# EAGLE schematic hub_keyboard (EAGLE 9.2.1)

## Sheet 1 of 2
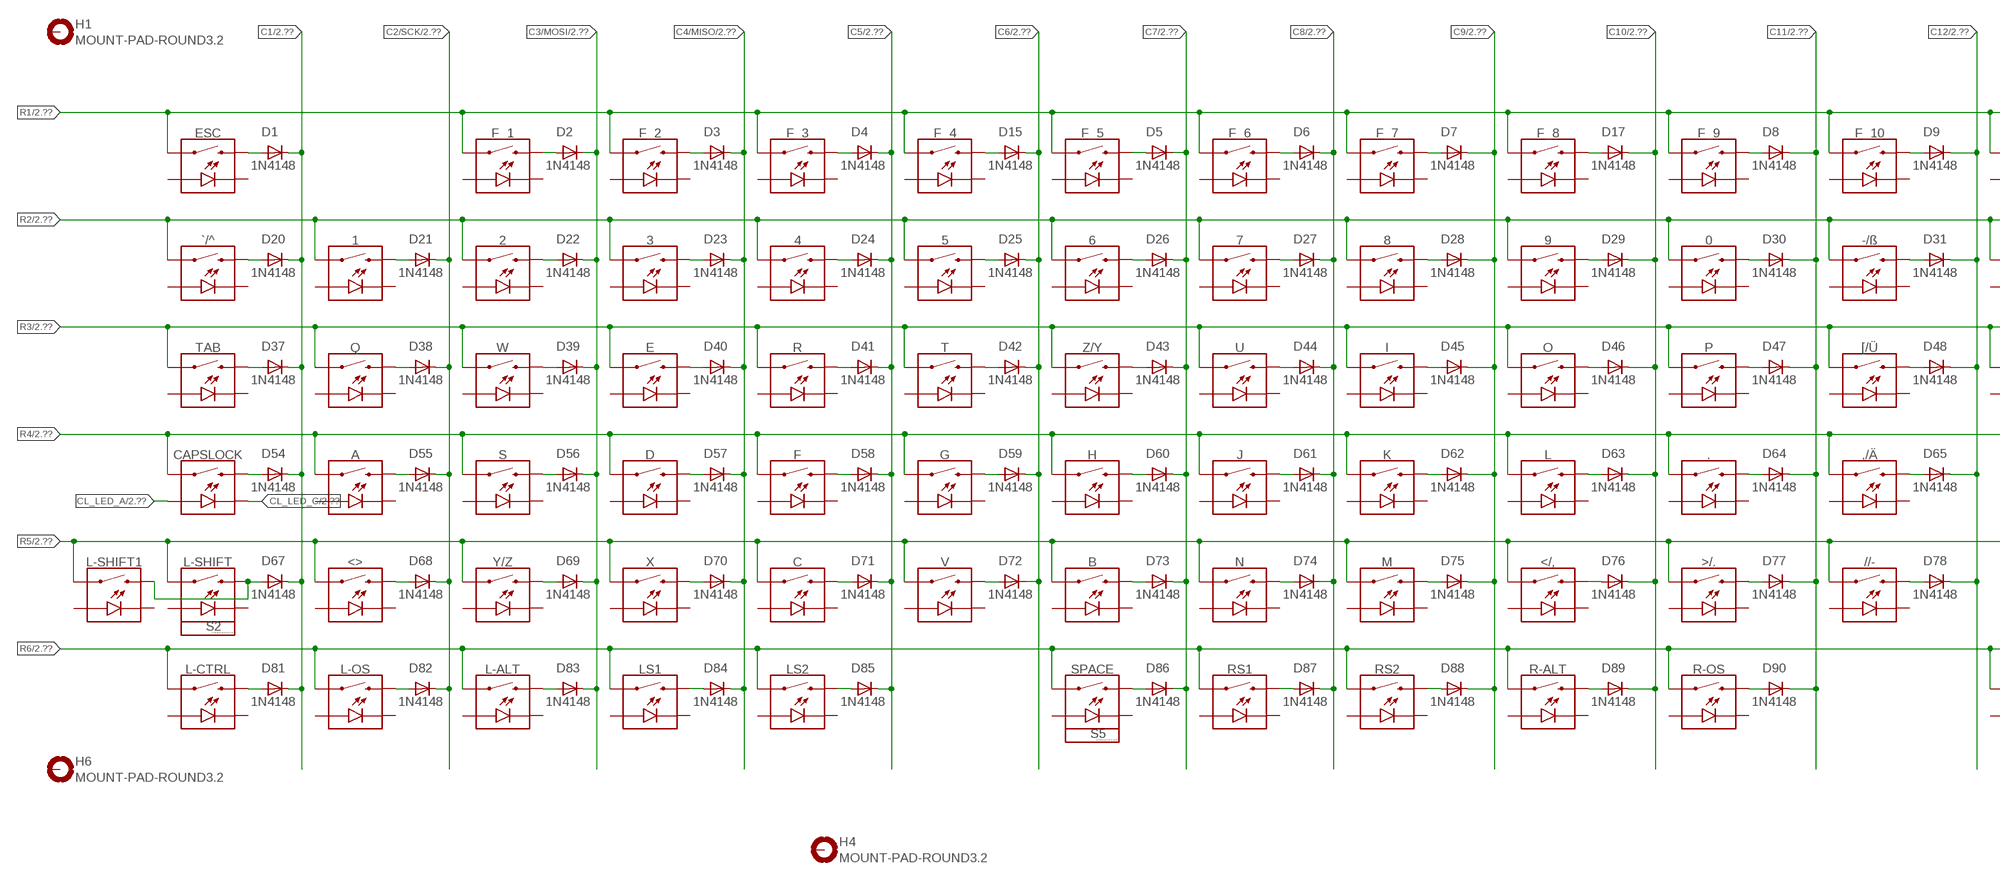
[diagram p0: schematic, sheet 1, part 1 of 2]
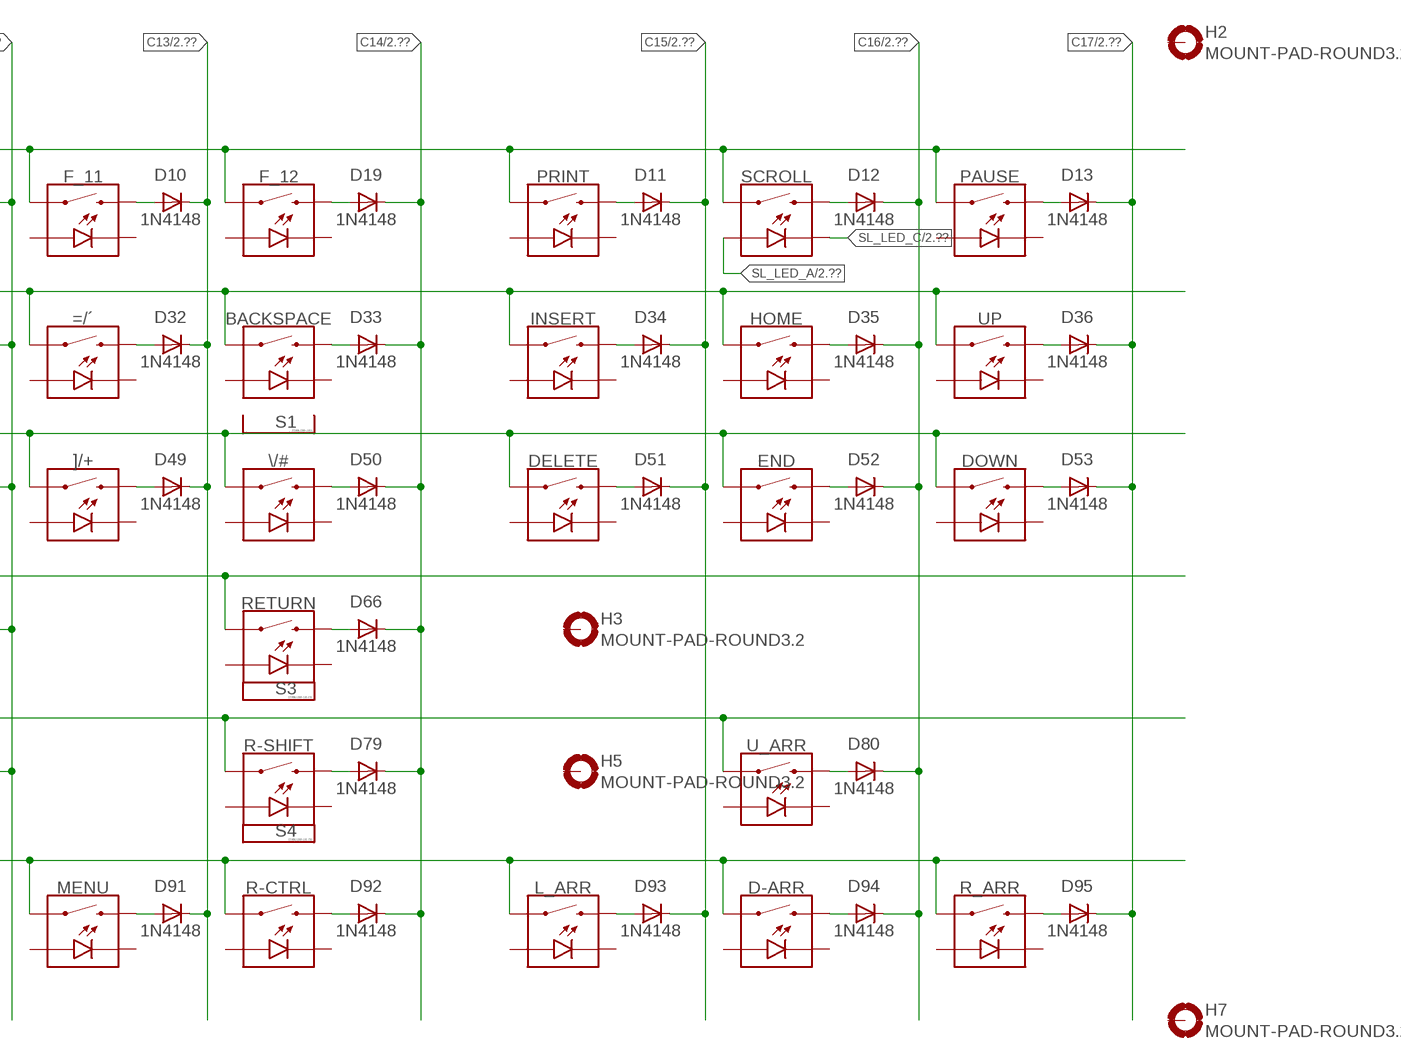
[diagram p1: schematic, sheet 1, part 2 of 2]

### Parts
0  MECHANICAL-KEYBOARD1U  [CHERRY-MX-LED-1U]
1  MECHANICAL-KEYBOARD1U  [CHERRY-MX-LED-1U]
2  MECHANICAL-KEYBOARD1U  [CHERRY-MX-LED-1U]
3  MECHANICAL-KEYBOARD1U  [CHERRY-MX-LED-1U]
4  MECHANICAL-KEYBOARD1U  [CHERRY-MX-LED-1U]
5  MECHANICAL-KEYBOARD1U  [CHERRY-MX-LED-1U]
6  MECHANICAL-KEYBOARD1U  [CHERRY-MX-LED-1U]
7  MECHANICAL-KEYBOARD1U  [CHERRY-MX-LED-1U]
8  MECHANICAL-KEYBOARD1U  [CHERRY-MX-LED-1U]
9  MECHANICAL-KEYBOARD1U  [CHERRY-MX-LED-1U]
,/Ä  MECHANICAL-KEYBOARD1U  [CHERRY-MX-LED-1U]
-/ß  MECHANICAL-KEYBOARD1U  [CHERRY-MX-LED-1U]
.  MECHANICAL-KEYBOARD1U  [CHERRY-MX-LED-1U]
//-  MECHANICAL-KEYBOARD1U  [CHERRY-MX-LED-1U]
</,  MECHANICAL-KEYBOARD1U  [CHERRY-MX-LED-1U]
<>  MECHANICAL-KEYBOARD1U  [CHERRY-MX-LED-1U]
=/´  MECHANICAL-KEYBOARD1U  [CHERRY-MX-LED-1U]
>/.  MECHANICAL-KEYBOARD1U  [CHERRY-MX-LED-1U]
[/Ü  MECHANICAL-KEYBOARD1U  [CHERRY-MX-LED-1U]
\\/#  MECHANICAL-KEYBOARD1.5U  [CHERRY-MX-LED-1.5U]
]/+  MECHANICAL-KEYBOARD1U  [CHERRY-MX-LED-1U]
`/^  MECHANICAL-KEYBOARD1U  [CHERRY-MX-LED-1U]
A  MECHANICAL-KEYBOARD1U  [CHERRY-MX-LED-1U]
B  MECHANICAL-KEYBOARD1U  [CHERRY-MX-LED-1U]
BACKSPACE  MECHANICAL-KEYBOARD2U  [CHERRY-MX-LED-1X2U]
C  MECHANICAL-KEYBOARD1U  [CHERRY-MX-LED-1U]
CAPSLOCK  MECHANICAL-KEYBOARD1.75U  [CHERRY-MX-LED-1.75U]
D  MECHANICAL-KEYBOARD1U  [CHERRY-MX-LED-1U]
D1  1N4148  DIODE-SOD123  [SOD123]
D2  1N4148  DIODE-SOD123  [SOD123]
D3  1N4148  DIODE-SOD123  [SOD123]
D4  1N4148  DIODE-SOD123  [SOD123]
D5  1N4148  DIODE-SOD123  [SOD123]
D6  1N4148  DIODE-SOD123  [SOD123]
D7  1N4148  DIODE-SOD123  [SOD123]
D8  1N4148  DIODE-SOD123  [SOD123]
D9  1N4148  DIODE-SOD123  [SOD123]
D10  1N4148  DIODE-SOD123  [SOD123]
D11  1N4148  DIODE-SOD123  [SOD123]
D12  1N4148  DIODE-SOD123  [SOD123]
D13  1N4148  DIODE-SOD123  [SOD123]
D15  1N4148  DIODE-SOD123  [SOD123]
D17  1N4148  DIODE-SOD123  [SOD123]
D19  1N4148  DIODE-SOD123  [SOD123]
D20  1N4148  DIODE-SOD123  [SOD123]
D21  1N4148  DIODE-SOD123  [SOD123]
D22  1N4148  DIODE-SOD123  [SOD123]
D23  1N4148  DIODE-SOD123  [SOD123]
D24  1N4148  DIODE-SOD123  [SOD123]
D25  1N4148  DIODE-SOD123  [SOD123]
D26  1N4148  DIODE-SOD123  [SOD123]
D27  1N4148  DIODE-SOD123  [SOD123]
D28  1N4148  DIODE-SOD123  [SOD123]
D29  1N4148  DIODE-SOD123  [SOD123]
D30  1N4148  DIODE-SOD123  [SOD123]
D31  1N4148  DIODE-SOD123  [SOD123]
D32  1N4148  DIODE-SOD123  [SOD123]
D33  1N4148  DIODE-SOD123  [SOD123]
D34  1N4148  DIODE-SOD123  [SOD123]
D35  1N4148  DIODE-SOD123  [SOD123]
D36  1N4148  DIODE-SOD123  [SOD123]
D37  1N4148  DIODE-SOD123  [SOD123]
D38  1N4148  DIODE-SOD123  [SOD123]
D39  1N4148  DIODE-SOD123  [SOD123]
D40  1N4148  DIODE-SOD123  [SOD123]
D41  1N4148  DIODE-SOD123  [SOD123]
D42  1N4148  DIODE-SOD123  [SOD123]
D43  1N4148  DIODE-SOD123  [SOD123]
D44  1N4148  DIODE-SOD123  [SOD123]
D45  1N4148  DIODE-SOD123  [SOD123]
D46  1N4148  DIODE-SOD123  [SOD123]
D47  1N4148  DIODE-SOD123  [SOD123]
D48  1N4148  DIODE-SOD123  [SOD123]
D49  1N4148  DIODE-SOD123  [SOD123]
D50  1N4148  DIODE-SOD123  [SOD123]
D51  1N4148  DIODE-SOD123  [SOD123]
D52  1N4148  DIODE-SOD123  [SOD123]
D53  1N4148  DIODE-SOD123  [SOD123]
D54  1N4148  DIODE-SOD123  [SOD123]
D55  1N4148  DIODE-SOD123  [SOD123]
D56  1N4148  DIODE-SOD123  [SOD123]
D57  1N4148  DIODE-SOD123  [SOD123]
D58  1N4148  DIODE-SOD123  [SOD123]
D59  1N4148  DIODE-SOD123  [SOD123]
D60  1N4148  DIODE-SOD123  [SOD123]
D61  1N4148  DIODE-SOD123  [SOD123]
D62  1N4148  DIODE-SOD123  [SOD123]
D63  1N4148  DIODE-SOD123  [SOD123]
D64  1N4148  DIODE-SOD123  [SOD123]
D65  1N4148  DIODE-SOD123  [SOD123]
D66  1N4148  DIODE-SOD123  [SOD123]
D67  1N4148  DIODE-SOD123  [SOD123]
D68  1N4148  DIODE-SOD123  [SOD123]
D69  1N4148  DIODE-SOD123  [SOD123]
D70  1N4148  DIODE-SOD123  [SOD123]
D71  1N4148  DIODE-SOD123  [SOD123]
D72  1N4148  DIODE-SOD123  [SOD123]
D73  1N4148  DIODE-SOD123  [SOD123]
D74  1N4148  DIODE-SOD123  [SOD123]
D75  1N4148  DIODE-SOD123  [SOD123]
D76  1N4148  DIODE-SOD123  [SOD123]
D77  1N4148  DIODE-SOD123  [SOD123]
D78  1N4148  DIODE-SOD123  [SOD123]
D79  1N4148  DIODE-SOD123  [SOD123]
D80  1N4148  DIODE-SOD123  [SOD123]
D81  1N4148  DIODE-SOD123  [SOD123]
D82  1N4148  DIODE-SOD123  [SOD123]
D83  1N4148  DIODE-SOD123  [SOD123]
D84  1N4148  DIODE-SOD123  [SOD123]
D85  1N4148  DIODE-SOD123  [SOD123]
D86  1N4148  DIODE-SOD123  [SOD123]
D87  1N4148  DIODE-SOD123  [SOD123]
D88  1N4148  DIODE-SOD123  [SOD123]
D89  1N4148  DIODE-SOD123  [SOD123]
D90  1N4148  DIODE-SOD123  [SOD123]
D91  1N4148  DIODE-SOD123  [SOD123]
D92  1N4148  DIODE-SOD123  [SOD123]
D93  1N4148  DIODE-SOD123  [SOD123]
D94  1N4148  DIODE-SOD123  [SOD123]
D95  1N4148  DIODE-SOD123  [SOD123]
D-ARR  MECHANICAL-KEYBOARD1U  [CHERRY-MX-LED-1U]
DELETE  MECHANICAL-KEYBOARD1U  [CHERRY-MX-LED-1U]
DOWN  MECHANICAL-KEYBOARD1U  [CHERRY-MX-LED-1U]
E  MECHANICAL-KEYBOARD1U  [CHERRY-MX-LED-1U]
END  MECHANICAL-KEYBOARD1U  [CHERRY-MX-LED-1U]
ESC  MECHANICAL-KEYBOARD1U  [CHERRY-MX-LED-1U]
F  MECHANICAL-KEYBOARD1U  [CHERRY-MX-LED-1U]
F_1  MECHANICAL-KEYBOARD1U  [CHERRY-MX-LED-1U]
F_2  MECHANICAL-KEYBOARD1U  [CHERRY-MX-LED-1U]
F_3  MECHANICAL-KEYBOARD1U  [CHERRY-MX-LED-1U]
F_4  MECHANICAL-KEYBOARD1U  [CHERRY-MX-LED-1U]
F_5  MECHANICAL-KEYBOARD1U  [CHERRY-MX-LED-1U]
F_6  MECHANICAL-KEYBOARD1U  [CHERRY-MX-LED-1U]
F_7  MECHANICAL-KEYBOARD1U  [CHERRY-MX-LED-1U]
F_8  MECHANICAL-KEYBOARD1U  [CHERRY-MX-LED-1U]
F_9  MECHANICAL-KEYBOARD1U  [CHERRY-MX-LED-1U]
F_10  MECHANICAL-KEYBOARD1U  [CHERRY-MX-LED-1U]
F_11  MECHANICAL-KEYBOARD1U  [CHERRY-MX-LED-1U]
F_12  MECHANICAL-KEYBOARD1U  [CHERRY-MX-LED-1U]
G  MECHANICAL-KEYBOARD1U  [CHERRY-MX-LED-1U]
H  MECHANICAL-KEYBOARD1U  [CHERRY-MX-LED-1U]
H1  MOUNT-PAD-ROUND3.2  [3,2-PAD]
H2  MOUNT-PAD-ROUND3.2  [3,2-PAD]
H3  MOUNT-PAD-ROUND3.2  [3,2-PAD]
H4  MOUNT-PAD-ROUND3.2  [3,2-PAD]
H5  MOUNT-PAD-ROUND3.2  [3,2-PAD]
H6  MOUNT-PAD-ROUND3.2  [3,2-PAD]
H7  MOUNT-PAD-ROUND3.2  [3,2-PAD]
HOME  MECHANICAL-KEYBOARD1U  [CHERRY-MX-LED-1U]
I  MECHANICAL-KEYBOARD1U  [CHERRY-MX-LED-1U]
INSERT  MECHANICAL-KEYBOARD1U  [CHERRY-MX-LED-1U]
J  MECHANICAL-KEYBOARD1U  [CHERRY-MX-LED-1U]
K  MECHANICAL-KEYBOARD1U  [CHERRY-MX-LED-1U]
L  MECHANICAL-KEYBOARD1U  [CHERRY-MX-LED-1U]
L-ALT  MECHANICAL-KEYBOARD1.25U  [CHERRY-MX-LED-1.25U]
L-CTRL  MECHANICAL-KEYBOARD1.25U  [CHERRY-MX-LED-1.25U]
L-OS  MECHANICAL-KEYBOARD1.25U  [CHERRY-MX-LED-1.25U]
L-SHIFT  MECHANICAL-KEYBOARD2.25U  [CHERRY-MX-LED-1X2.25]
L-SHIFT1  MECHANICAL-KEYBOARD1.25U  [CHERRY-MX-LED-1.25U]
L_ARR  MECHANICAL-KEYBOARD1U  [CHERRY-MX-LED-1U]
LS1  MECHANICAL-KEYBOARD1.25U  [CHERRY-MX-LED-1.25U]
LS2  MECHANICAL-KEYBOARD1.25U  [CHERRY-MX-LED-1.25U]
M  MECHANICAL-KEYBOARD1U  [CHERRY-MX-LED-1U]
MENU  MECHANICAL-KEYBOARD1.25U  [CHERRY-MX-LED-1.25U]
N  MECHANICAL-KEYBOARD1U  [CHERRY-MX-LED-1U]
O  MECHANICAL-KEYBOARD1U  [CHERRY-MX-LED-1U]
P  MECHANICAL-KEYBOARD1U  [CHERRY-MX-LED-1U]
PAUSE  MECHANICAL-KEYBOARD1U  [CHERRY-MX-LED-1U]
PRINT  MECHANICAL-KEYBOARD1U  [CHERRY-MX-LED-1U]
Q  MECHANICAL-KEYBOARD1U  [CHERRY-MX-LED-1U]
R  MECHANICAL-KEYBOARD1U  [CHERRY-MX-LED-1U]
R-ALT  MECHANICAL-KEYBOARD1.25U  [CHERRY-MX-LED-1.25U]
R-CTRL  MECHANICAL-KEYBOARD1.25U  [CHERRY-MX-LED-1.25U]
R-OS  MECHANICAL-KEYBOARD1.25U  [CHERRY-MX-LED-1.25U]
R-SHIFT  MECHANICAL-KEYBOARD2.75U  [CHERRY-MX-LED-1X2.75]
R_ARR  MECHANICAL-KEYBOARD1U  [CHERRY-MX-LED-1U]
RETURN  MECHANICAL-KEYBOARD2.25U  [CHERRY-MX-LED-1X2.25]
RS1  MECHANICAL-KEYBOARD1.25U  [CHERRY-MX-LED-1.25U]
RS2  MECHANICAL-KEYBOARD1.25U  [CHERRY-MX-LED-1.25U]
S  MECHANICAL-KEYBOARD1U  [CHERRY-MX-LED-1U]
S1  STABILIZER-1X2U  [STABILIZER_1X2U]
S2  STABILIZER-1X2.25U  [STABILIZER_1X2.25U]
S3  STABILIZER-1X2.25U  [STABILIZER_1X2.25U]
S4  STABILIZER-1X2.75U  [STABILIZER_1X2.75U]
S5  STABILIZER-1X6.25U  [STABILIZER_1X6.25U]
SCROLL  MECHANICAL-KEYBOARD1U  [CHERRY-MX-LED-1U]
SPACE  MECHANICAL-KEYBOARD6.25U  [CHERRY-MX-LED-1X6.25]
T  MECHANICAL-KEYBOARD1U  [CHERRY-MX-LED-1U]
TAB  MECHANICAL-KEYBOARD1.5U  [CHERRY-MX-LED-1.5U]
U  MECHANICAL-KEYBOARD1U  [CHERRY-MX-LED-1U]
U_ARR  MECHANICAL-KEYBOARD1U  [CHERRY-MX-LED-1U]
UP  MECHANICAL-KEYBOARD1U  [CHERRY-MX-LED-1U]
V  MECHANICAL-KEYBOARD1U  [CHERRY-MX-LED-1U]
W  MECHANICAL-KEYBOARD1U  [CHERRY-MX-LED-1U]
X  MECHANICAL-KEYBOARD1U  [CHERRY-MX-LED-1U]
Y/Z  MECHANICAL-KEYBOARD1U  [CHERRY-MX-LED-1U]
Z/Y  MECHANICAL-KEYBOARD1U  [CHERRY-MX-LED-1U]

### Nets
C1: D1.C D20.C D37.C D54.C D67.C D81.C ; also sheet 2
C2/SCK: D21.C D38.C D55.C D68.C D82.C ; also sheet 2
C3/MOSI: D2.C D22.C D39.C D56.C D69.C D83.C ; also sheet 2
C4/MISO: D3.C D23.C D40.C D57.C D70.C D84.C ; also sheet 2
C5: D4.C D24.C D41.C D58.C D71.C D85.C ; also sheet 2
C6: D15.C D25.C D42.C D59.C D72.C ; also sheet 2
C7: D5.C D26.C D43.C D60.C D73.C D86.C ; also sheet 2
C8: D6.C D27.C D44.C D61.C D74.C D87.C ; also sheet 2
C9: D7.C D28.C D45.C D62.C D75.C D88.C ; also sheet 2
C10: D17.C D29.C D46.C D63.C D76.C D89.C ; also sheet 2
C11: D8.C D30.C D47.C D64.C D77.C D90.C ; also sheet 2
C12: D9.C D31.C D48.C D65.C D78.C ; also sheet 2
C13: D10.C D32.C D49.C D91.C ; also sheet 2
C14: D19.C D33.C D50.C D66.C D79.C D92.C ; also sheet 2
C15: D11.C D34.C D51.C D93.C ; also sheet 2
C16: D12.C D35.C D52.C D80.C D94.C ; also sheet 2
C17: D13.C D36.C D53.C D95.C ; also sheet 2
CL_LED_A: CAPSLOCK.A ; also sheet 2
CL_LED_C: CAPSLOCK.K(C) ; also sheet 2
N$1: D11.A PRINT.S2
N$2: D34.A INSERT.S2
N$3: D51.A DELETE.S2
N$4: D12.A SCROLL.S2
N$5: D35.A HOME.S2
N$6: D93.A L_ARR.S2
N$7: D52.A END.S2
N$9: D80.A U_ARR.S2
N$10: D94.A D-ARR.S2
N$11: D13.A PAUSE.S2
N$12: D36.A UP.S2
N$13: D53.A DOWN.S2
N$14: <>.S2 D68.A
N$16: D95.A R_ARR.S2
N$21: D1.A ESC.S2
N$22: `/^.S2 D20.A
N$23: D37.A TAB.S2
N$24: CAPSLOCK.S2 D54.A
N$25: D67.A L-SHIFT1.S2 L-SHIFT.S2
N$26: D81.A L-CTRL.S2
N$27: 1.S2 D21.A
N$28: D38.A Q.S2
N$29: A.S2 D55.A
N$30: D69.A Y/Z.S2
N$31: D82.A L-OS.S2
N$32: D2.A F_1.S2
N$33: 2.S2 D22.A
N$34: D39.A W.S2
N$35: D56.A S.S2
N$36: D70.A X.S2
N$37: D83.A L-ALT.S2
N$38: D3.A F_2.S2
N$39: 3.S2 D23.A
N$40: D40.A E.S2
N$41: D57.A D.S2
N$42: C.S2 D71.A
N$43: D4.A F_3.S2
N$44: 4.S2 D24.A
N$45: D41.A R.S2
N$46: D58.A F.S2
N$47: D72.A V.S2
N$48: D15.A F_4.S2
N$49: 5.S2 D25.A
N$50: D42.A T.S2
N$51: D59.A G.S2
N$52: B.S2 D73.A
N$53: D86.A SPACE.S2
N$54: D5.A F_5.S2
N$55: 6.S2 D26.A
N$56: D43.A Z/Y.S2
N$57: D60.A H.S2
N$58: D74.A N.S2
N$59: D6.A F_6.S2
N$60: 7.S2 D27.A
N$61: D44.A U.S2
N$62: D61.A J.S2
N$63: D75.A M.S2
N$64: D7.A F_7.S2
N$65: 8.S2 D28.A
N$66: D45.A I.S2
N$67: D62.A K.S2
N$68: </,.S2 D76.A
N$69: D17.A F_8.S2
N$70: 9.S2 D29.A
N$71: D46.A O.S2
N$72: D63.A L.S2
N$73: >/..S2 D77.A
N$74: D89.A R-ALT.S2
N$75: D8.A F_9.S2
N$76: 0.S2 D30.A
N$77: D47.A P.S2
N$78: ..S2 D64.A
N$79: //-.S2 D78.A
N$80: D90.A R-OS.S2
N$81: D9.A F_10.S2
N$82: -/ß.S2 D31.A
N$83: [/Ü.S2 D48.A
N$84: ,/Ä.S2 D65.A
N$85: D10.A F_11.S2
N$86: =/´.S2 D32.A
N$87: ]/+.S2 D49.A
N$88: D91.A MENU.S2
N$89: D19.A F_12.S2
N$90: BACKSPACE.S2 D33.A
N$91: \\/#.S2 D50.A
N$92: D66.A RETURN.S2
N$93: D79.A R-SHIFT.S2
N$94: D92.A R-CTRL.S2
N$137: D85.A LS2.S2
N$138: D84.A LS1.S2
N$140: D88.A RS2.S2
N$141: D87.A RS1.S2
R1: ESC.S1 F_1.S1 F_2.S1 F_3.S1 F_4.S1 F_5.S1 F_6.S1 F_7.S1 F_8.S1 F_9.S1 F_10.S1 F_11.S1 F_12.S1 PAUSE.S1 PRINT.S1 SCROLL.S1 ; also sheet 2
R2: 0.S1 1.S1 2.S1 3.S1 4.S1 5.S1 6.S1 7.S1 8.S1 9.S1 -/ß.S1 =/´.S1 `/^.S1 BACKSPACE.S1 HOME.S1 INSERT.S1 UP.S1 ; also sheet 2
R3: [/Ü.S1 \\/#.S1 ]/+.S1 DELETE.S1 DOWN.S1 E.S1 END.S1 I.S1 O.S1 P.S1 Q.S1 R.S1 T.S1 TAB.S1 U.S1 W.S1 Z/Y.S1 ; also sheet 2
R4: ,/Ä.S1 ..S1 A.S1 CAPSLOCK.S1 D.S1 F.S1 G.S1 H.S1 J.S1 K.S1 L.S1 RETURN.S1 S.S1 ; also sheet 2
R5: //-.S1 </,.S1 <>.S1 >/..S1 B.S1 C.S1 L-SHIFT1.S1 L-SHIFT.S1 M.S1 N.S1 R-SHIFT.S1 U_ARR.S1 V.S1 X.S1 Y/Z.S1 ; also sheet 2
R6: D-ARR.S1 L-ALT.S1 L-CTRL.S1 L-OS.S1 L_ARR.S1 LS1.S1 LS2.S1 MENU.S1 R-ALT.S1 R-CTRL.S1 R-OS.S1 R_ARR.S1 RS1.S1 RS2.S1 SPACE.S1 ; also sheet 2
SL_LED_A: SCROLL.A ; also sheet 2
SL_LED_C: SCROLL.K(C) ; also sheet 2
Unconnected: 0.A 0.K(C) 1.A 1.K(C) 2.A 2.K(C) 3.A 3.K(C) 4.A 4.K(C) 5.A 5.K(C) 6.A 6.K(C) 7.A 7.K(C) 8.A 8.K(C) 9.A 9.K(C) ,/Ä.A ,/Ä.K(C) -/ß.A -/ß.K(C) ..A ..K(C) //-.A //-.K(C) </,.A </,.K(C) <>.A <>.K(C) =/´.A =/´.K(C) >/..A >/..K(C) [/Ü.A [/Ü.K(C) \\/#.A \\/#.K(C) ]/+.A ]/+.K(C) `/^.A `/^.K(C) A.A A.K(C) B.A B.K(C) BACKSPACE.A BACKSPACE.K(C) C.A C.K(C) D-ARR.A D-ARR.K(C) D.A D.K(C) DELETE.A DELETE.K(C) DOWN.A DOWN.K(C) E.A E.K(C) END.A END.K(C) ESC.A ESC.K(C) F.A F.K(C) F_1.A F_1.K(C) F_2.A F_2.K(C) F_3.A F_3.K(C) F_4.A F_4.K(C) F_5.A F_5.K(C) F_6.A F_6.K(C) F_7.A F_7.K(C) F_8.A F_8.K(C) F_9.A F_9.K(C) F_10.A F_10.K(C) F_11.A F_11.K(C) F_12.A F_12.K(C) G.A G.K(C) H1.B3,2(MOUNT) H2.B3,2(MOUNT) H3.B3,2(MOUNT) H4.B3,2(MOUNT) H5.B3,2(MOUNT) H6.B3,2(MOUNT) H7.B3,2(MOUNT) H.A H.K(C) HOME.A HOME.K(C) I.A I.K(C) INSERT.A INSERT.K(C) J.A J.K(C) K.A K.K(C) L-ALT.A L-ALT.K(C) L-CTRL.A L-CTRL.K(C) L-OS.A L-OS.K(C) L-SHIFT1.A L-SHIFT1.K(C) L-SHIFT.A L-SHIFT.K(C) L.A L.K(C) L_ARR.A L_ARR.K(C) LS1.A LS1.K(C) LS2.A LS2.K(C) M.A M.K(C) MENU.A MENU.K(C) N.A N.K(C) O.A O.K(C) P.A P.K(C) PAUSE.A PAUSE.K(C) PRINT.A PRINT.K(C) Q.A Q.K(C) R-ALT.A R-ALT.K(C) R-CTRL.A R-CTRL.K(C) R-OS.A R-OS.K(C) R-SHIFT.A R-SHIFT.K(C) R.A R.K(C) R_ARR.A R_ARR.K(C) RETURN.A RETURN.K(C) RS1.A RS1.K(C) RS2.A RS2.K(C) S.A S.K(C) SPACE.A SPACE.K(C) T.A T.K(C) TAB.A TAB.K(C) U.A U.K(C) U_ARR.A U_ARR.K(C) UP.A UP.K(C) V.A V.K(C) W.A W.K(C) X.A X.K(C) Y/Z.A Y/Z.K(C) Z/Y.A Z/Y.K(C)

## Sheet 2 of 2
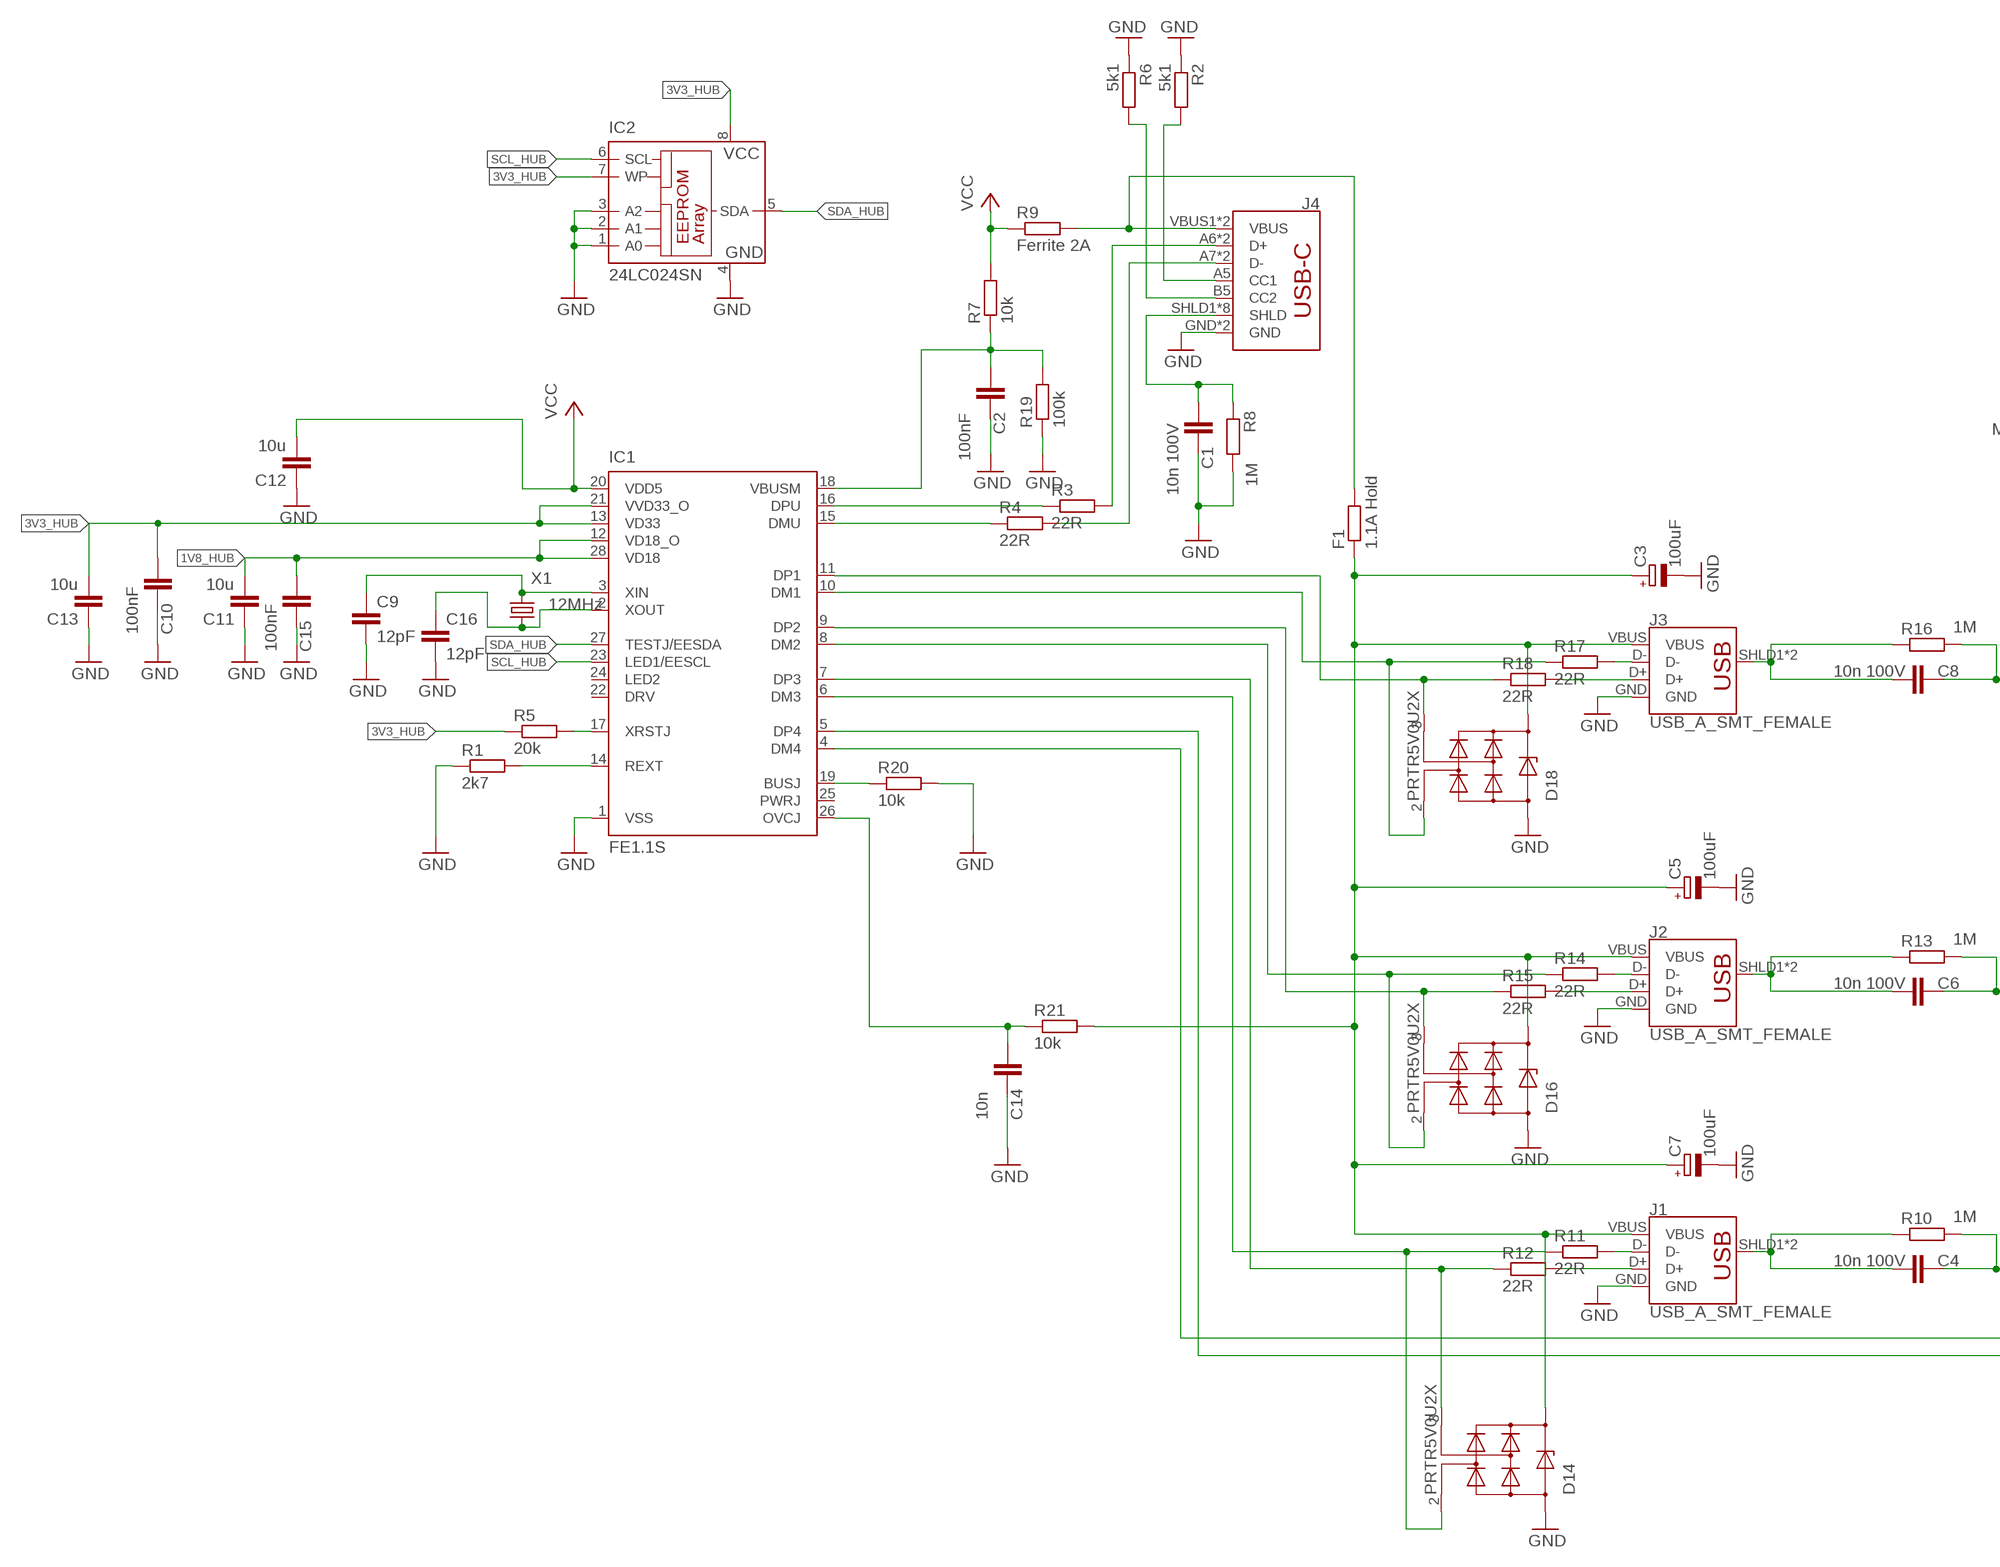
[diagram p2: schematic, sheet 2, part 1 of 2]
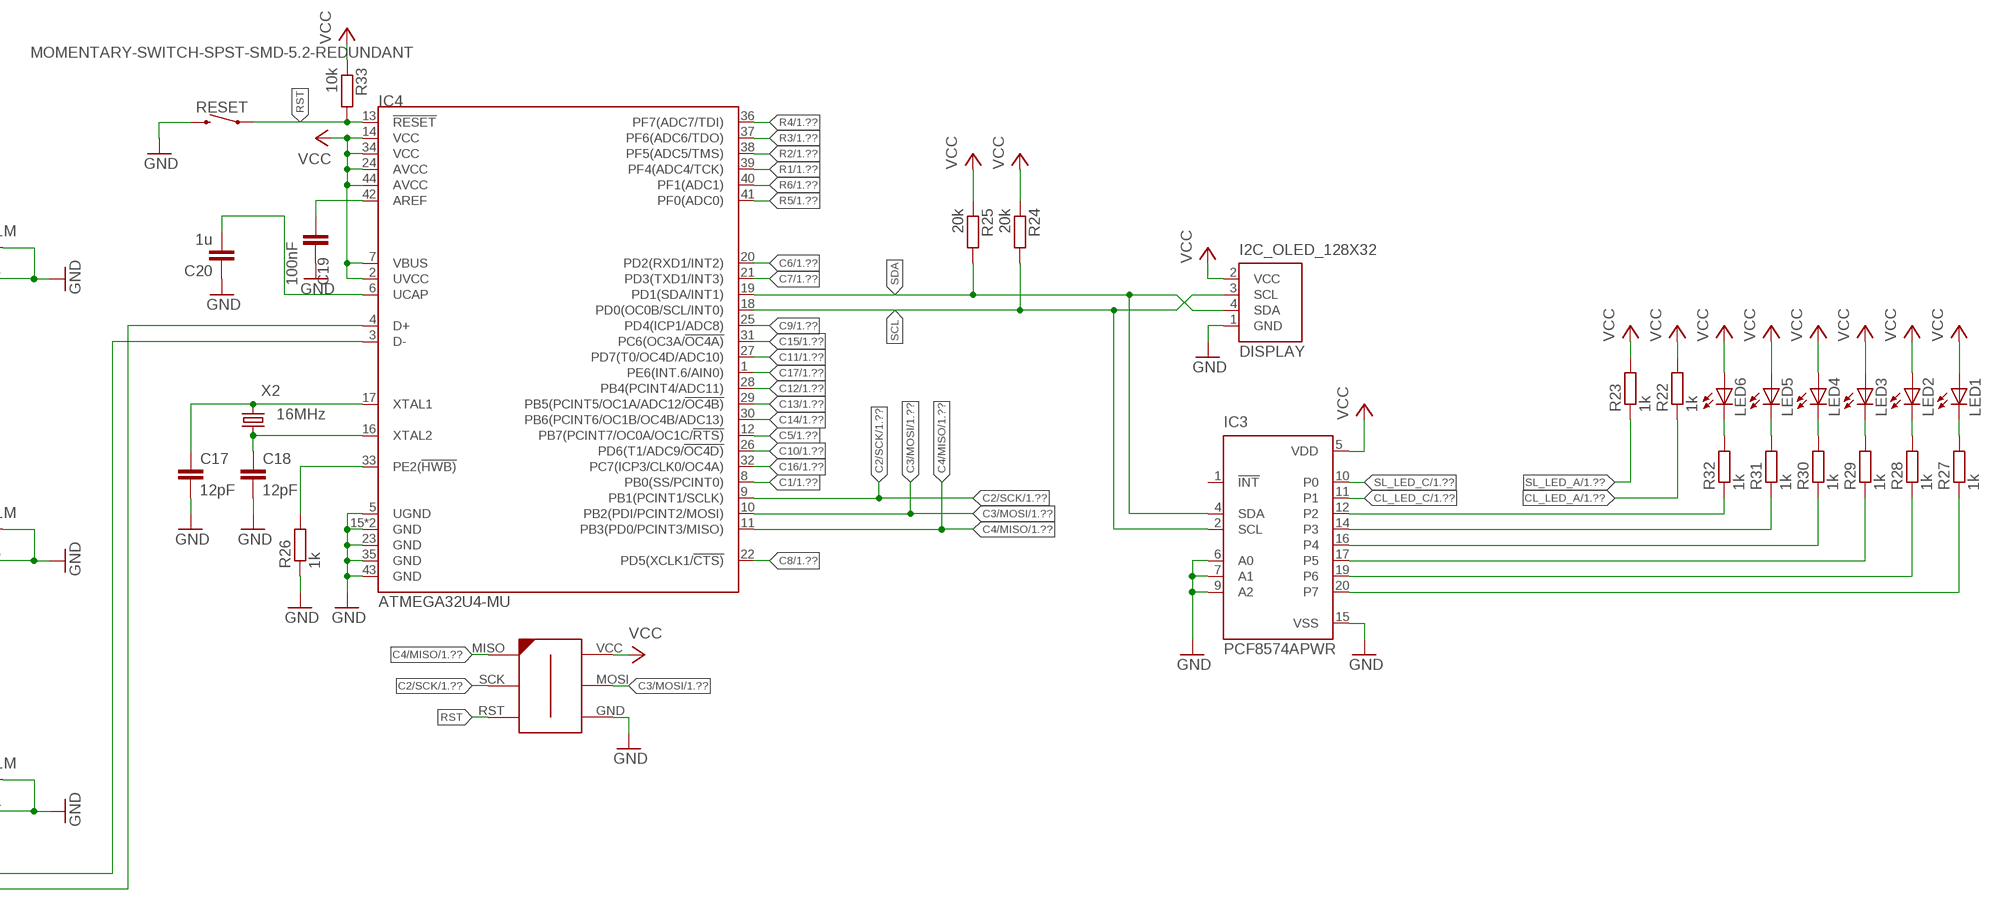
[diagram p3: schematic, sheet 2, part 2 of 2]

### Parts
C1  10n 100V  C-EUC0603  [C0603]
C2  100nF  C-EUC0603  [C0603]
C3  100uF  CPOL-EUCT3528  [CT3528]
C4  10n 100V  C-EUC0603  [C0603]
C5  100uF  CPOL-EUCT3528  [CT3528]
C6  10n 100V  C-EUC0603  [C0603]
C7  100uF  CPOL-EUCT3528  [CT3528]
C8  10n 100V  C-EUC0603  [C0603]
C9  12pF  C-EUC0603  [C0603]
C10  100nF  C-EUC0603  [C0603]
C11  10u  C-EUC0603  [C0603]
C12  10u  C-EUC0603  [C0603]
C13  10u  C-EUC0603  [C0603]
C14  10n  C-EUC0603  [C0603]
C15  100nF  C-EUC0603  [C0603]
C16  12pF  C-EUC0603  [C0603]
C17  12pF  C-EUC0603  [C0603]
C18  12pF  C-EUC0603  [C0603]
C19  100nF  C-EUC0603  [C0603]
C20  1u  C-EUC0603  [C0603]
D14  PRTR5V0U2X  [SOT143]
D16  PRTR5V0U2X  [SOT143]
D18  PRTR5V0U2X  [SOT143]
DISPLAY  I2C_OLED_128X32  [128X32_I2C_OLED]
F1  1.1A Hold  R-EU_R1210  [R1210]
IC1  FE1.1S  [SSOP28]
IC2  24LC024SN  [SO-08]
IC3  PCF8574APWR  PCF8574TS  [SSOP20]
IC4  ATMEGA32U4-MU  MCU-ATMEGA32U4-MUR(VQFN44)  [QFN44G-0.5-7X7MM]
ISP  AVR-ISP-6-EDGE  [6PAD_ISP]
J1  USB_A_SMT_FEMALE  [USB-A-S-SILK-FEMALE]
J2  USB_A_SMT_FEMALE  [USB-A-S-SILK-FEMALE]
J3  USB_A_SMT_FEMALE  [USB-A-S-SILK-FEMALE]
J4  USB_C2-LAYER  [USB-C-16P]
LED1  LED3MM  [LED3MM]
LED2  LED3MM  [LED3MM]
LED3  LED3MM  [LED3MM]
LED4  LED3MM  [LED3MM]
LED5  LED3MM  [LED3MM]
LED6  LED3MM  [LED3MM]
R1  2k7  R-EU_R0603  [R0603]
R2  5k1  R-EU_R0603  [R0603]
R3  22R  R-EU_R0603  [R0603]
R4  22R  R-EU_R0603  [R0603]
R5  20k  R-EU_R0603  [R0603]
R6  5k1  R-EU_R0603  [R0603]
R7  10k  R-EU_R0603  [R0603]
R8  1M  R-EU_R0603  [R0603]
R9  Ferrite 2A  R-EU_R0805  [R0805]
R10  1M  R-EU_R0603  [R0603]
R11  22R  R-EU_R0603  [R0603]
R12  22R  R-EU_R0603  [R0603]
R13  1M  R-EU_R0603  [R0603]
R14  22R  R-EU_R0603  [R0603]
R15  22R  R-EU_R0603  [R0603]
R16  1M  R-EU_R0603  [R0603]
R17  22R  R-EU_R0603  [R0603]
R18  22R  R-EU_R0603  [R0603]
R19  100k  R-EU_R0603  [R0603]
R20  10k  R-EU_R0603  [R0603]
R21  10k  R-EU_R0603  [R0603]
R22  1k  R-EU_R0603  [R0603]
R23  1k  R-EU_R0603  [R0603]
R24  20k  R-EU_R0603  [R0603]
R25  20k  R-EU_R0603  [R0603]
R26  1k  R-EU_R0603  [R0603]
R27  1k  R-EU_R0603  [R0603]
R28  1k  R-EU_R0603  [R0603]
R29  1k  R-EU_R0603  [R0603]
R30  1k  R-EU_R0603  [R0603]
R31  1k  R-EU_R0603  [R0603]
R32  1k  R-EU_R0603  [R0603]
R33  10k  R-EU_R0603  [R0603]
RESET  MOMENTARY-SWITCH-SPST-SMD-5.2-REDUNDANT  [TACTILE_SWITCH_SMD_5.2MM]
X1  12MHz  KX-7  [3.2X2.5_KX-7]
X2  16MHz  KX-7  [3.2X2.5_KX-7]

### Nets
1V8_HUB: C11.2 C15.2 IC1.12(VD18_O) IC1.28(VD18)
3V3_HUB: C10.2 C13.2 IC1.13(VD33) IC1.21(VVD33_O) IC2.7(WP) IC2.8(VCC) R5.1
C1: IC4.8(PB0(SS/PCINT0)) ; also sheet 1
C2/SCK: IC4.9(PB1(PCINT1/SCLK)) ISP.SCK ; also sheet 1
C3/MOSI: IC4.10(PB2(PDI/PCINT2/MOSI)) ISP.MOSI ; also sheet 1
C4/MISO: IC4.11(PB3(PD0/PCINT3/MISO)) ISP.MISO ; also sheet 1
C5: IC4.12(PB7(PCINT7/OC0A/OC1C/!RTS)) ; also sheet 1
C6: IC4.20(PD2(RXD1/INT2)) ; also sheet 1
C7: IC4.21(PD3(TXD1/INT3)) ; also sheet 1
C8: IC4.22(PD5(XCLK1/!CTS)) ; also sheet 1
C9: IC4.25(PD4(ICP1/ADC8)) ; also sheet 1
C10: IC4.26(PD6(T1/ADC9/!OC4D)) ; also sheet 1
C11: IC4.27(PD7(T0/OC4D/ADC10)) ; also sheet 1
C12: IC4.28(PB4(PCINT4/ADC11)) ; also sheet 1
C13: IC4.29(PB5(PCINT5/OC1A/ADC12/!OC4B)) ; also sheet 1
C14: IC4.30(PB6(PCINT6/OC1B/OC4B/ADC13)) ; also sheet 1
C15: IC4.31(PC6(OC3A/!OC4A)) ; also sheet 1
C16: IC4.32(PC7(ICP3/CLK0/OC4A)) ; also sheet 1
C17: IC4.1(PE6(INT.6/AIN0)) ; also sheet 1
CL_LED_A: R22.1 ; also sheet 1
CL_LED_C: IC3.11(P1) ; also sheet 1
GND: C1.1 C2.1 C3.- C4.1 C5.- C6.1 C7.- C8.1 C9.2 C10.1 C11.1 C12.1 C13.1 C14.1 C15.1 C16.2 C17.2 C18.2 C19.1 C20.1 D14.1(GND) D16.1(GND) D18.1(GND) DISPLAY.1(GND) IC1.1(VSS) IC2.1(A0) IC2.2(A1) IC2.3(A2) IC2.4(GND) IC3.6(A0) IC3.7(A1) IC3.9(A2) IC3.15(VSS) IC4.5(UGND) IC4.15(GND) IC4.23(GND) IC4.35(GND) IC4.43(GND) IC4.TAB(GND) ISP.GND J1.GND J2.GND J3.GND J4.GND J4.GND2(GND) R1.1 R2.1 R6.1 R8.2 R10.2 R13.2 R16.2 R19.1 R20.2 R26.1 RESET.3 RESET.4
N$8: IC4.33(PE2(!HWB)) R26.2
N$15: IC1.17(XRSTJ) R5.2
N$17: IC1.14(REXT) R1.2
N$18: IC1.19(BUSJ) R20.1
N$19: J4.A5(CC1) R2.2
N$20: C3.+ C5.+ C7.+ D14.4(VCC) D16.4(VCC) D18.4(VCC) F1.1 J1.VBUS J2.VBUS J3.VBUS R21.2
N$95: C14.2 IC1.26(OVCJ) R21.1
N$96: F1.2 J4.VBUS1(VBUS) J4.VBUS2(VBUS) R9.2
N$97: D16.2(IO1) IC1.8(DM2) R14.1
N$98: D16.3(IO2) IC1.9(DP2) R15.1
N$99: D14.3(IO2) IC1.7(DP3) R12.1
N$100: D14.2(IO1) IC1.6(DM3) R11.1
N$101: J4.A7(D-) J4.B7(D-) R4.2
N$102: J4.A6(D+) J4.B6(D+) R3.2
N$103: C9.1 IC1.3(XIN) X1.3
N$104: IC1.15(DMU) R4.1
N$105: IC1.16(DPU) R3.1
N$106: IC1.4(DM4) IC4.3(D-)
N$107: IC1.5(DP4) IC4.4(D+)
N$108: C2.2 IC1.18(VBUSM) R7.1 R19.2
N$109: C17.1 IC4.17(XTAL1) X2.3
N$110: C18.1 IC4.16(XTAL2) X2.1
N$111: C20.2 IC4.6(UCAP)
N$112: C8.2 J3.SHLD1(SHIELD) J3.SHLD2(SHIELD) R16.1
N$113: C6.2 J2.SHLD1(SHIELD) J2.SHLD2(SHIELD) R13.1
N$114: C4.2 J1.SHLD1(SHIELD) J1.SHLD2(SHIELD) R10.1
N$115: C1.2 J4.SHLD1(SHLD) J4.SHLD2(SHLD) J4.SHLD3(SHLD) J4.SHLD4(SHLD) J4.SHLD5(SHLD) J4.SHLD6(SHLD) J4.SHLD7(SHLD) J4.SHLD8(SHLD) R8.1
N$116: J4.B5(CC2) R6.2
N$117: C19.2 IC4.42(AREF)
N$118: C16.1 IC1.2(XOUT) X1.1
N$119: LED6.K(C) R32.2
N$120: LED5.K(C) R31.2
N$121: LED4.K(C) R30.2
N$122: LED3.K(C) R29.2
N$123: LED2.K(C) R28.2
N$124: LED1.K(C) R27.2
N$125: IC3.12(P2) R32.1
N$126: IC3.14(P3) R31.1
N$127: IC3.16(P4) R30.1
N$128: IC3.17(P5) R29.1
N$129: IC3.19(P6) R28.1
N$130: IC3.20(P7) R27.1
N$131: J3.D- R17.2
N$132: J3.D+ R18.2
N$133: J2.D- R14.2
N$134: J2.D+ R15.2
N$135: J1.D- R11.2
N$136: J1.D+ R12.2
R1: IC4.39(PF4(ADC4/TCK)) ; also sheet 1
R2: IC4.38(PF5(ADC5/TMS)) ; also sheet 1
R3: IC4.37(PF6(ADC6/TDO)) ; also sheet 1
R4: IC4.36(PF7(ADC7/TDI)) ; also sheet 1
R5: IC4.41(PF0(ADC0)) ; also sheet 1
R6: IC4.40(PF1(ADC1)) ; also sheet 1
RST: IC4.13(!RESET) ISP.RST R33.2 RESET.1 RESET.2
SCL: DISPLAY.3(SCL) IC3.2(SCL) IC4.18(PD0(OC0B/SCL/INT0)) R24.2
SCL_HUB: IC1.23(LED1/EESCL) IC2.6(SCL)
SDA: DISPLAY.4(SDA) IC3.4(SDA) IC4.19(PD1(SDA/INT1)) R25.2
SDA_HUB: IC1.27(TESTJ/EESDA) IC2.5(SDA)
SL_LED_A: R23.1 ; also sheet 1
SL_LED_C: IC3.10(P0) ; also sheet 1
USB1N: D18.2(IO1) IC1.10(DM1) R17.1
USB1P: D18.3(IO2) IC1.11(DP1) R18.1
VCC: C12.2 DISPLAY.2(VCC) IC1.20(VDD5) IC3.5(VDD) IC4.2(UVCC) IC4.7(VBUS) IC4.14(VCC) IC4.24(AVCC) IC4.34(VCC) IC4.44(AVCC) ISP.VCC LED1.A LED2.A LED3.A LED4.A LED5.A LED6.A R7.2 R9.1 R22.2 R23.2 R24.1 R25.1 R33.1
Unconnected: IC1.22(DRV) IC1.24(LED2) IC1.25(PWRJ) IC3.1(!INT)

## Library data of the parts
0 1-9 ,/Ä -/ß . //- </, <> =/´ >/. [/Ü \\/# ]/+ `/^ A B BACKSPACE C CAPSLOCK D D-ARR DELETE DOWN E END ESC F F_1-F_12 G H HOME I INSERT J K L L-ALT L-CTRL L-OS L-SHIFT L-SHIFT1 L_ARR LS1 LS2 M MENU N O P PAUSE PRINT Q R R-ALT R-CTRL R-OS R-SHIFT R_ARR RETURN RS1 RS2 S SCROLL SPACE T TAB U U_ARR UP V W X Y/Z Z/Y = SparkFun-Switches:MECHANICAL-KEYBOARD: Mechanical Keyboard Spacings for Cherry-MX Cherry-MX w/ LED switch footprints. Each package variant contains a bounding box on the tDocu layer for proper key spacing and a dimensional drawing on the Reference layer to be exported for laser cut mounting plates. Footprints are off-center so that the origin lies on the lower left corner of the key-spacing. This allows for most common layouts to be easily acheived on a grid spacing of 0.1875" Variants 1U through 1.75U in .25U steps Centered switch cutout in SwitchPlate layer with no stabilizers 2U through 2.75U in .25U steps Centered switch cutout in SwitchPlate layer with Cherry+Costar stabilizer holes 6.25U Common spacebar size Centered switch cutout in SwitchPlate layer with Cherry+Costar stabilizer holes "Big Ass" Enter ANSI 104 "Big Ass" Enter Key layout ISO Enter ISO style Enter Key layout
C1 C4 C6 C8 = rcl:C-EU: CAPACITOR, European symbol; EXTENDED: TRUE; LCSC: C84709; SPICEPREFIX: C
C2 C10 C15 C19 = rcl:C-EU: CAPACITOR, European symbol; LCSC: C14663; SPICEPREFIX: C
C3 C5 C7 = rcl:CPOL-EU: POLARIZED CAPACITOR, European symbol; LCSC: C16133; SPICEPREFIX: C
C9 C16-C18 = rcl:C-EU: CAPACITOR, European symbol; LCSC: C38523; SPICEPREFIX: C
C11-C13 = rcl:C-EU: CAPACITOR, European symbol; LCSC: C19702; SPICEPREFIX: C
C14 = rcl:C-EU: CAPACITOR, European symbol; LCSC: C57112; SPICEPREFIX: C
C20 = rcl:C-EU: CAPACITOR, European symbol; LCSC: C15849; SPICEPREFIX: C
D1-D13 D15 D17 D19-D95 = diode:DIODE-: DIODE; LCSC: C81598
D14 D16 D18 = diode:PRTR5V0U2X: Ultra low capacitance double rail-to-rail ESD protection TVS diode; DIGIKEY: 1727-3884-1-ND; EXTENDED: TRUE; FARNELL: 1524157; LCSC: C384891
DISPLAY = display:I2C_OLED: I2C OLED
F1 = rcl:R-EU_: RESISTOR, European symbol; EXTENDED: TRUE; LCSC: C70100; SPICEPREFIX: R
H1-H7 = holes:MOUNT-PAD-ROUND: MOUNTING PAD, round
IC1 = Terminus:FE1.1S: TERMINUS FE1.1S USB 2.0 HIGH SPEED 4-PORT HUB CONTROLLER; EXTENDED: TRUE; LCSC: C9359
IC2 = microchip:24*: Serial EEPROM I2C; EXTENDED: TRUE; LCSC: C184083; MF: MICROCHIP; MPN: 24LC024/SN; OC_FARNELL: 1659744; OC_NEWARK: 92C7092
IC3 = micro-philips:PCF8574: I2C-Bus Remote 8-bit I/O expander http://www.semiconductors.philips.com/acrobat_download/datasheets/PCF8574_4.pdf; LCSC: C94361; MPN: PCF8574TS/3,118; OC_FARNELL: 1506644; OC_NEWARK: 70R6873
IC4 = MCU-ATMEGA32U4-MUR_VQFN44_:MCU-ATMEGA32U4-MUR(VQFN44): 310010016; AVAILABILITY: Unavailable; DESCRIPTION: ATmega Series 32 KB Flash 2.5 KB SRAM 16 MHz 8-Bit Microcontroller - MLF/QFN-44; EXTENDED: TRUE; LCSC: C112161; MF: Microchip; MP: ATMEGA32U4-MUR; PACKAGE: VQFN-44 Microchip; PRICE: None
ISP = avr-7:AVR-ISP-6-EDGE: 6 pin edge connector for ISP with ATMEL MCUs. Developed by Craig Moates (craig at moates dot net). Library by David Blundell (blundar at gmail dot com). Often, even a 6 pin header is really inconvenient for board layout and/or production. This SMD-only header is our de-facto standard for using an edge connector for programming with the help of a 6pin/10pin to edge card adapter.
J1-J3 = SparkFun-Connectors:USB_A: USB-A Connector Male and female variants, as well as PTH and SMT variants SparkFun Products: SparkFun XBee Explorer Dongle <https://www.sparkfun.com/products/11697> PTH Male SparkFun MicroView-USB Programmer <https://www.sparkfun.com/products/12924> SMT Male SparkFun USB Type A Female Breakout <https://www.sparkfun.com/products/12700> SMT Female; DIGIKEY: 609-4946-1-ND; PROD_ID: CONN-09520; SF_ID: PRT-09011
J4 = SparkFun-Connectors:USB_C: USB Type C 16Pin Connector Super Speed pins not available on the 16-pin purely SMD connector so this part is best for USB 2.0 implementations. D1 and D2 are tied together enabling D+/- no matter which way the cable is plugged into the connector. The two channel configuration pins (CC1/2) are exposed. These are normally connected to ground via 5.1k resistors but can be reconfigured for high current/high power applications.; DIGIKEY: 2073-USB4105-GF-ACT-ND; PROD_ID: CONN-14122
LED1-LED6 = led:LED: LED OSRAM: - CHIPLED LG R971, LG N971, LY N971, LG Q971, LY Q971, LO R971, LY R971 LH N974, LH R974 LS Q976, LO Q976, LY Q976 LO Q996 - Hyper CHIPLED LW Q18S LB Q993, LB Q99A, LB R99A - SideLED LS A670, LO A670, LY A670, LG A670, LP A670 LB A673, LV A673, LT A673, LW A673 LH A674 LY A675 LS A676, LA A676, LO A676, LY A676, LW A676 LS A679, LY A679, LG A679 - Hyper Micro SIDELED® LS Y876, LA Y876, LO Y876, LY Y876 LT Y87S - SmartLED LW L88C, LW L88S LB L89C, LB L89S, LG L890 LS L89K, LO L89K, LY L89K LS L896, LA L896, LO L896, LY L896 - TOPLED LS T670, LO T670, LY T670, LG T670, LP T670 LSG T670, LSP T670, LSY T670, LOP T670, LYG T670 LG T671, LOG T671, LSG T671 LB T673, LV T673, LT T673, LW T673 LH T674 LS T676, LA T676, LO T676, LY T676, LB T676, LH T676, LSB T676, LW T676 LB T67C, LV T67C, LT T67C, LS T67K, LO T67K, LY T67K, LW E67C LS E67B, LA E67B, LO E67B, LY E67B, LB E67C, LV E67C, LT E67C LW T67C LS T679, LY T679, LG T679 LS T770, LO T770, LY T770, LG T770, LP T770 LB T773, LV T773, LT T773, LW T773 LH T774 LS E675, LA E675, LY E675, LS T675 LS T776, LA T776, LO T776, LY T776, LB T776 LHGB T686 LT T68C, LB T68C - Hyper Mini TOPLED® LB M676 - Mini TOPLED Santana® LG M470 LS M47K, LO M47K, LY M47K Source: http://www.osram.convergy.de LUXEON: - LUMILED® LXK2-PW12-R00, LXK2-PW12-S00, LXK2-PW14-U00, LXK2-PW14-V00 LXK2-PM12-R00, LXK2-PM12-S00, LXK2-PM14-U00 LXK2-PE12-Q00, LXK2-PE12-R00, LXK2-PE12-S00, LXK2-PE14-T00, LXK2-PE14-U00 LXK2-PB12-K00, LXK2-PB12-L00, LXK2-PB12-M00, LXK2-PB14-N00, LXK2-PB14-P00, LXK2-PB14-Q00 LXK2-PR12-L00, LXK2-PR12-M00, LXK2-PR14-Q00, LXK2-PR14-R00 LXK2-PD12-Q00, LXK2-PD12-R00, LXK2-PD12-S00 LXK2-PH12-R00, LXK2-PH12-S00 LXK2-PL12-P00, LXK2-PL12-Q00, LXK2-PL12-R00 Source: www.luxeon.com KINGBRIGHT: KA-3528ASYC Source: www.kingbright.com
R1 = rcl:R-EU_: RESISTOR, European symbol; LCSC: C13167; SPICEPREFIX: R
R2 R6 = rcl:R-EU_: RESISTOR, European symbol; LCSC: C23186; SPICEPREFIX: R
R3 R4 R11 R12 R14 R15 R17 R18 = rcl:R-EU_: RESISTOR, European symbol; LCSC: C23345; SPICEPREFIX: R
R5 R24 R25 = rcl:R-EU_: RESISTOR, European symbol; LCSC: C4184; SPICEPREFIX: R
R7 R20 R21 R33 = rcl:R-EU_: RESISTOR, European symbol; LCSC: C25804; SPICEPREFIX: R
R8 R10 R13 R16 = rcl:R-EU_: RESISTOR, European symbol; LCSC: C22935; SPICEPREFIX: R
R9 = rcl:R-EU_: RESISTOR, European symbol; EXTENDED: TRUE; LCSC: C44361; SPICEPREFIX: R
R19 = rcl:R-EU_: RESISTOR, European symbol; LCSC: C25803; SPICEPREFIX: R
R22 R23 R26-R32 = rcl:R-EU_: RESISTOR, European symbol; LCSC: C21190; SPICEPREFIX: R
RESET = SparkFun-Switches:MOMENTARY-SWITCH-SPST: Momentary Switch (Pushbutton) - SPST Normally-open (NO) SPST momentary switches (buttons, pushbuttons). Variants PTH-12MM - 12mm square, through-hole Momentary Pushbutton Switch - 12mm Square <https://www.sparkfun.com/products/9190> (COM-09190) PTH-6.0MM, PTH-6.0MM-KIT - 6.0mm square, through-hole Mini Pushbutton Switch <https://www.sparkfun.com/products/97> (COM-00097) KIT package intended for soldering kit's - only one side of pads' copper is exposed. PTH-RIGHT-ANGLE-KIT - Right-angle, through-hole Right Angle Tactile Button <https://www.sparkfun.com/products/10791> - Used on SparkFun BigTime Watch Kit <https://www.sparkfun.com/products/11734> SMD-12MM - 12mm square, surface-mount Tactile Button - SMD (12mm) <https://www.sparkfun.com/products/12993> (COM-12993) Used on SparkFun PicoBoard <https://www.sparkfun.com/products/11888> SMD-4.5MM - 4.5mm Square Trackball Switch Used on SparkFun Blackberry Trackballer Breakout <https://www.sparkfun.com/products/13169> SMD-4.6MMX2.8MM - 4.60mm x 2.80mm, surface mount Used on SparkFun SAMD21 Mini Breakout <https://www.sparkfun.com/products/13664> SMD-5.2MM, SMD-5.2-REDUNDANT - 5.2mm square, surface-mount Mini Pushbutton Switch - SMD <https://www.sparkfun.com/products/8720> (COM-08720) Used on Arduino Pro Mini <https://www.sparkfun.com/products/11114> REDUNDANT package connects both switch circuits together SMD-6.0X3.5MM - 6.0 x 3.5mm, surface mount Momentary Reset Switch SMD <https://www.sparkfun.com/products/8229> (COM-08229) SMD-6.2MM-TALL - 6.2mm square, surface mount Tactile Button - SMD (6mm) <https://www.sparkfun.com/products/12992> Used on SparkFun Digital Sandbox <https://www.sparkfun.com/products/12651> SMD-RIGHT-ANGLE - Right-angle, surface mount Used on SparkFun Block for Intel® Edison - Arduino <https://www.sparkfun.com/products/13036>; EXTENDED: TRUE; LCSC: C318884; PROD_ID: SWCH-08247; SF_SKU: COM-08720
S1-S5 = SparkFun-Switches:STABILIZER: Keyboard Stabilizer
X1 = crystal-geyer_V1_0:KX: Quartz Crystals (MHz) SMD: KX - Serie Model Size l/w/h [mm] Frequency Range Frequency Stability Temp. Range [°C] Load Capacitance AECQ 200 availabel Datasheet KX-4 KX-5 KX-6 KX-7 KX-9A KX-9B KX-12A KX-12B KX-13 KX-20 KX-K KX-KS 1.6/1.2/0.3 2.0/1.6/0.45 2.5/2.0/0.55 3.2/2.5/0.8 5.0/3.2/1.0 5.0/3.2/1.1 6.0/3.5/1.1 6.0/3.5/1.0 7.0/5.0 /1.3 11.6/5.5/1.6 12.3/4.5/4.2 12.3/4.5/3.2 24.0 ~ 80.0 MHz 16.0 ~ 80.0 MHz 12.0 ~ 80.0 MHz 8.0 ~ 60.0 MHz 7,68 ~ 300,0 MHz 8,0 ~ 50,0 MHz 8,0 ~ 150,0 MHz 8,0 ~ 50,0 MHz 6,0 ~ 160,0 MHz 3,579 ~ 25,0 MHz 3,579 ~ 70,0 MHz 3,579 ~ 70,0 MHz ±10 … ±50ppm ±10 … ±50ppm ±10 … ±50ppm ±10 … ±50ppm ±10 … ±50ppm ±10 … ±50ppm ±10 … ±50ppm ±10 … ±50ppm ±10 … ±50ppm ±50ppm ±10 … ±50ppm ±10 … ±50ppm (*) -40°C …+85°C (*) -40°C …+125°C (*) -40°C …+125°C (*) -40°C …+125°C (*) -40°C …+105°C (*) -40°C …+105°C (*) -40°C …+125°C (*) -40°C …+105°C (*) -40°C …+105°C (*) -40°C …+105°C (*) -40°C …+85°C (*) -40°C …+85°C 8, 8…16 8, 8…16 10, 8…16 12, 7…20 16, 10…20 16, 10…20 16, 10…20 16, 12…20 16, 12…20 16, 12…20 16, 12…30 16, 12…30 - yes yes yes - - - - - - - - KX-4.pdf <http://www.geyer-electronic.de/uploads/tx_userartikelfrequenz/GEYER-KX-4.pdf> KX-5.pdf <http://www.geyer-electronic.de/uploads/tx_userartikelfrequenz/GEYER-KX-5.pdf> KX-6.pdf <http://www.geyer-electronic.de/uploads/tx_userartikelfrequenz/GEYER-KX-6.pdf> KX-7.pdf <http://www.geyer-electronic.de/uploads/tx_userartikelfrequenz/GEYER-KX-7.pdf> KX-9A.pdf <http://www.geyer-electronic.de/uploads/tx_userartikelfrequenz/GEYER-KX-9A.pdf> KX-9B.pdf <http://www.geyer-electronic.de/uploads/tx_userartikelfrequenz/GEYER-KX-9B.pdf> KX-12A.pdf <http://www.geyer-electronic.de/uploads/tx_userartikelfrequenz/GEYER-KX-12A.pdf> KX-12B.pdf <http://www.geyer-electronic.de/uploads/tx_userartikelfrequenz/GEYER-KX-12B.pdf> KX-13.pdf <http://www.geyer-electronic.de/uploads/tx_userartikelfrequenz/GEYER-KX-13.pdf> KX-20.pdf <http://www.geyer-electronic.de/uploads/tx_userartikelfrequenz/GEYER-KX-20.pdf> KX-K.pdf <http://www.geyer-electronic.de/uploads/tx_userartikelfrequenz/GEYER-KX-K.pdf> KX-KS.pdf <http://www.geyer-electronic.de/uploads/tx_userartikelfrequenz/GEYER-KX-KS.pdf> <http://www.geyer-electronic.de/fileadmin/template/img/logo-geyer-electronic.png> Details see: http://www.geyer-electronic.de/Frequenz-Produkte.9.0.html Created 2016-06-07, Hans Locher 2016 (C) Geyer Quartz Technology KX4,KX5,KX6,KX7,KX9A,KX9B,KX12A,KX12B,KX13,KX20,KXK,KXKS;1612;2016;2520;3225;5032;6035;7050;11655;12345;1,6x1,2;2,0x1,6;2,5x2,0;3,2x2,5;5,0x3,2;6,0x3,5;7,0x5,0;11,6x5,5;12,3x4,5;12,3x4,5;1.6x1.2;2.0x1.6;2.5x2.0;3.2x2.5;5.0x3.2;6.0x3.5;7.0x5.0;11.6x5.5;12.3x4.5;12.3x4.5;; LCSC: C9002
X2 = crystal-geyer_V1_0:KX: Quartz Crystals (MHz) SMD: KX - Serie Model Size l/w/h [mm] Frequency Range Frequency Stability Temp. Range [°C] Load Capacitance AECQ 200 availabel Datasheet KX-4 KX-5 KX-6 KX-7 KX-9A KX-9B KX-12A KX-12B KX-13 KX-20 KX-K KX-KS 1.6/1.2/0.3 2.0/1.6/0.45 2.5/2.0/0.55 3.2/2.5/0.8 5.0/3.2/1.0 5.0/3.2/1.1 6.0/3.5/1.1 6.0/3.5/1.0 7.0/5.0 /1.3 11.6/5.5/1.6 12.3/4.5/4.2 12.3/4.5/3.2 24.0 ~ 80.0 MHz 16.0 ~ 80.0 MHz 12.0 ~ 80.0 MHz 8.0 ~ 60.0 MHz 7,68 ~ 300,0 MHz 8,0 ~ 50,0 MHz 8,0 ~ 150,0 MHz 8,0 ~ 50,0 MHz 6,0 ~ 160,0 MHz 3,579 ~ 25,0 MHz 3,579 ~ 70,0 MHz 3,579 ~ 70,0 MHz ±10 … ±50ppm ±10 … ±50ppm ±10 … ±50ppm ±10 … ±50ppm ±10 … ±50ppm ±10 … ±50ppm ±10 … ±50ppm ±10 … ±50ppm ±10 … ±50ppm ±50ppm ±10 … ±50ppm ±10 … ±50ppm (*) -40°C …+85°C (*) -40°C …+125°C (*) -40°C …+125°C (*) -40°C …+125°C (*) -40°C …+105°C (*) -40°C …+105°C (*) -40°C …+125°C (*) -40°C …+105°C (*) -40°C …+105°C (*) -40°C …+105°C (*) -40°C …+85°C (*) -40°C …+85°C 8, 8…16 8, 8…16 10, 8…16 12, 7…20 16, 10…20 16, 10…20 16, 10…20 16, 12…20 16, 12…20 16, 12…20 16, 12…30 16, 12…30 - yes yes yes - - - - - - - - KX-4.pdf <http://www.geyer-electronic.de/uploads/tx_userartikelfrequenz/GEYER-KX-4.pdf> KX-5.pdf <http://www.geyer-electronic.de/uploads/tx_userartikelfrequenz/GEYER-KX-5.pdf> KX-6.pdf <http://www.geyer-electronic.de/uploads/tx_userartikelfrequenz/GEYER-KX-6.pdf> KX-7.pdf <http://www.geyer-electronic.de/uploads/tx_userartikelfrequenz/GEYER-KX-7.pdf> KX-9A.pdf <http://www.geyer-electronic.de/uploads/tx_userartikelfrequenz/GEYER-KX-9A.pdf> KX-9B.pdf <http://www.geyer-electronic.de/uploads/tx_userartikelfrequenz/GEYER-KX-9B.pdf> KX-12A.pdf <http://www.geyer-electronic.de/uploads/tx_userartikelfrequenz/GEYER-KX-12A.pdf> KX-12B.pdf <http://www.geyer-electronic.de/uploads/tx_userartikelfrequenz/GEYER-KX-12B.pdf> KX-13.pdf <http://www.geyer-electronic.de/uploads/tx_userartikelfrequenz/GEYER-KX-13.pdf> KX-20.pdf <http://www.geyer-electronic.de/uploads/tx_userartikelfrequenz/GEYER-KX-20.pdf> KX-K.pdf <http://www.geyer-electronic.de/uploads/tx_userartikelfrequenz/GEYER-KX-K.pdf> KX-KS.pdf <http://www.geyer-electronic.de/uploads/tx_userartikelfrequenz/GEYER-KX-KS.pdf> <http://www.geyer-electronic.de/fileadmin/template/img/logo-geyer-electronic.png> Details see: http://www.geyer-electronic.de/Frequenz-Produkte.9.0.html Created 2016-06-07, Hans Locher 2016 (C) Geyer Quartz Technology KX4,KX5,KX6,KX7,KX9A,KX9B,KX12A,KX12B,KX13,KX20,KXK,KXKS;1612;2016;2520;3225;5032;6035;7050;11655;12345;1,6x1,2;2,0x1,6;2,5x2,0;3,2x2,5;5,0x3,2;6,0x3,5;7,0x5,0;11,6x5,5;12,3x4,5;12,3x4,5;1.6x1.2;2.0x1.6;2.5x2.0;3.2x2.5;5.0x3.2;6.0x3.5;7.0x5.0;11.6x5.5;12.3x4.5;12.3x4.5;; LCSC: C13738